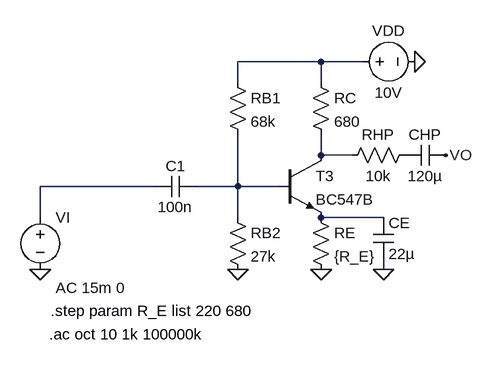
[diagram p0: schematic 2_3_1_g.asc]
2_3_1_g.asc, the LTspice schematic file:
Version 4
SHEET 1 880 680
WIRE 400 -96 272 -96
WIRE 464 -96 400 -96
WIRE 272 -64 272 -96
WIRE 400 -64 400 -96
WIRE 400 48 400 16
WIRE 448 48 400 48
WIRE 144 96 -32 96
WIRE 272 96 272 16
WIRE 272 96 208 96
WIRE 336 96 272 96
WIRE -32 144 -32 96
WIRE 272 144 272 96
WIRE 496 144 400 144
WIRE 496 224 496 208
FLAG 544 -96 0
FLAG 272 224 0
FLAG 400 224 0
FLAG 496 224 0
FLAG 592 48 VO
FLAG -32 224 0
SYMBOL cap 208 80 R90
WINDOW 0 0 32 VBottom 2
WINDOW 3 32 32 VTop 2
SYMATTR InstName C1
SYMATTR Value 100n
SYMBOL res 256 128 R0
SYMATTR InstName RB2
SYMATTR Value 27k
SYMBOL res 256 -80 R0
SYMATTR InstName RB1
SYMATTR Value 68k
SYMBOL res 384 -80 R0
SYMATTR InstName RC
SYMATTR Value 680
SYMBOL res 384 128 R0
SYMATTR InstName RE
SYMATTR Value {R_E}
SYMBOL cap 480 144 R0
SYMATTR InstName CE
SYMATTR Value 22µ
SYMBOL voltage 448 -96 R270
WINDOW 0 32 56 VTop 2
WINDOW 3 -32 56 VBottom 2
SYMATTR InstName VDD
SYMATTR Value 10V
SYMBOL npn 336 48 R0
SYMATTR InstName T3
SYMATTR Value BC547B
SYMBOL res 544 32 R90
WINDOW 0 0 56 VBottom 2
WINDOW 3 32 56 VTop 2
SYMATTR InstName RHP
SYMATTR Value 10k
SYMBOL cap 592 32 R90
WINDOW 0 0 32 VBottom 2
WINDOW 3 32 32 VTop 2
SYMATTR InstName CHP
SYMATTR Value 120µ
SYMBOL voltage -32 128 R0
WINDOW 123 24 124 Left 2
WINDOW 39 0 0 Left 0
SYMATTR InstName VI
SYMATTR Value ""
SYMATTR Value2 AC 15m 0
TEXT -16 288 Left 2 !.step param R_E list 220 680
TEXT -18 324 Left 2 !.ac oct 10 1k 100000k

The netlist it stands for:
* 2_3_1_g.asc
C1 N004 N003 100n
RB2 N004 0 27k
RB1 N001 N004 68k
RC N001 N002 680
RE N005 0 {R_E}
CE N005 0 22µ
VDD N001 0 10V
Q§T3 N002 N004 N005 0 BC547B
RHP P001 N002 10k
CHP VO P001 120µ
VI N003 0 AC 15m 0
.model NPN NPN
.model PNP PNP
.lib standard.bjt
.step param R_E list 220 680
.ac oct 10 1k 100000k
.backanno
.end